# Altium schematic sheet Sheet2-power.SchDoc
size A4; SheetNumber: 2; SheetTotal: 2
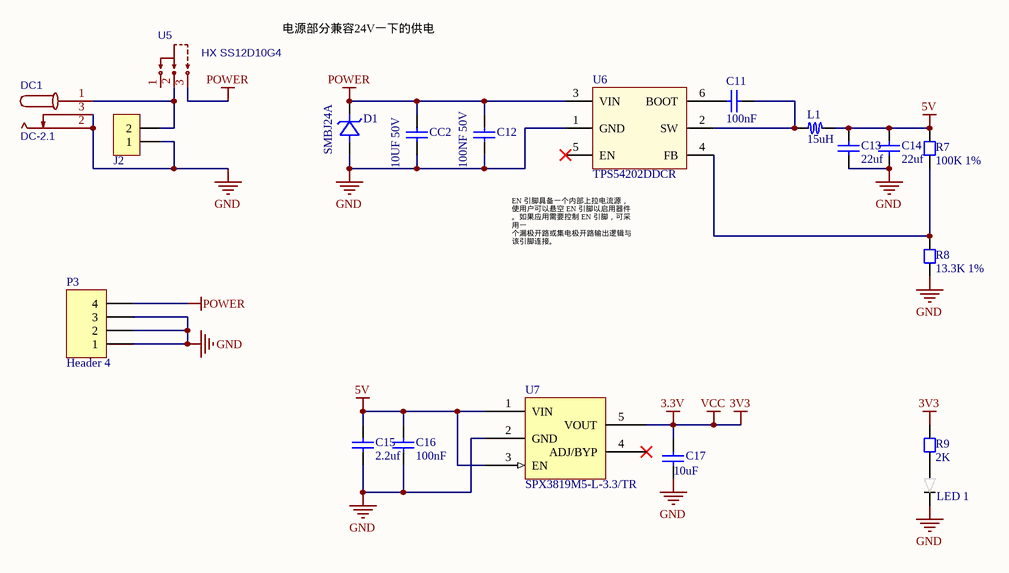
[diagram p0: Sheet2-power.SchDoc]

## Parts
C11  100nF  [CC1608-0603]
C12  100NF 50V  [CC1608-0603]
C13  22uf  [CC1608-0603]
C14  22uf  [CC1608-0603]
C15  2.2uf  [CC1608-0603]
C16  100nF  [CC1608-0603]
C17  10uF  [CC1608-0603]
CC2  value 10UF 50V  [CC3216-1206]  (hidden comment: Cap Chip 1206)
D1  SMBJ24A  [DO-214 AA]
DC1  DC-2.1  [DC-IN-SMD_DC-050-25A]
J2  HDR-1X3  [KF301-5.0-2P]  (value not drawn)
L1  15uH  [Inductor-4018]
LED_1  LED 0603  [LED 0603]  (value not drawn)
P3  Header 4  [HDR1X4]
R7  100K 1%  [CR1608-0603]
R8  13.3K 1%  [CR1608-0603]
R9  2K  [CR1608-0603]
U5  HX SS12D10G4  [SS12D10-G4]
U6  TPS54202DDCR  [SOT23-6]
U7  SPX3819M5-L-3.3/TR  [SOT23-5]

## Nets
3.3V: C17.1 R9.1 U7.5(VOUT)  [also labelled 3V3, VCC]
5V: C13.2 C14.2 C15.2 C16.2 L1.2 R7.2 U7.1(VIN) U7.3(EN)
GND: C12.1 C13.1 C14.1 C15.1 C16.1 C17.2 CC2.1 D1.2(A) DC1.2 DC1.3 J2.1 LED_1.2 P3.1 P3.2 P3.3 R8.1 U6.1(GND) U7.2(GND)
POWER: C12.2 CC2.2 D1.1(K) P3.4 U5.3 U6.3(VIN)
NetC11_1: C11.1 U6.6(BOOT)
NetC11_2: C11.2 L1.1 U6.2(SW)
NetDC1_1: DC1.1 J2.2 U5.2
NetLED_1_1: LED_1.1 R9.2
NetR7_1: R7.1 R8.2 U6.4(FB)

Not connected (* = marked no-connect by the designer): U5 1; U6 5(EN)*; U7 4(ADJ/BYP)*

## Notes on the sheet
- 电源部分兼容24V一下的供电
- EN 引脚具备一个内部上拉电流源，使用户可以悬空 EN 引脚以启用器件。如果应用需要控制 EN 引脚，可采用一
  个漏极开路或集电极开路输出逻辑与该引脚连接。

## Library data of the parts
C11-C16 = Cap Chip 0603: 0603封装的电容; Published: 8-Jun-2000; Revision: July-2002: Re-released for DXP Platform.; Publisher: Altium Limited
C17 = Chip capacitor: 贴片电容
CC2 = Cap Chip 1206: Polarized Capacitor (Radial); Published: 8-Jun-2000; Revision: July-2002: Re-released for DXP Platform.; Publisher: Altium Limited
D1 = SMBJ18A: TVS稳压二极管
DC1 = DC-050: DC贴片插座; BOM_Manufacturer: 韩国韩荣; BOM_Manufacturer Part: DC-050-25A; Contributor: LCSC; BOM_Supplier: LCSC; BOM_Supplier Part: C707275; BOM_JLCPCB Part Class: Extended Part; spicePre: D; spiceSymbolName: DC-050-25A
J2 = KF301 2P: 2P拧螺丝接口; BOM名称: 3P接插件; 版权归属: 封装库来自淘宝 ID：黄晶宝石; 学习资源: https://shop463601444.taobao.com
L1 = Inductor-4018: 贴片电感 1206封装
P3 = Header 4: Header, 4-Pin; LatestRevisionDate: 17-Jul-2002; LatestRevisionNote: Re-released for DXP Platform.; Publisher: Altium Limited
R7-R9 = Resistor Chip 0603: 0603封装电阻; Published: 8-Jun-2000; Revision: July-2002: Re-released for DXP Platform.; Publisher: Altium Limited
U5 = SS12D10G4: BOM_Manufacturer: hanxia(韩下); Contributor: lcsc; BOM_Supplier: LCSC; BOM_Supplier Part: C5149841; BOM_Manufacturer Part: HX SS12D10G4; link: https://atta.szlcsc.com/upload/public/pdf/source/20220907/2020D7183ED16DD6E2B9F5A13FB144CF.pdf; BOM_JLCPCB Part Class: Extended Part; spicePre: U; spiceSymbolName: HX SS12D10G4
U6 = TPS54202DDCR: 同步降压转换器芯片 500Khz 4.2~28V输入，2A输出
U7 = SPX3819M5-L-3.3/TR: LDO 3.3V , SOT-23-5 500ma